# Altium schematic sheet SuperCap.SchDoc
size A4; SheetNumber: 3; SheetTotal: 3
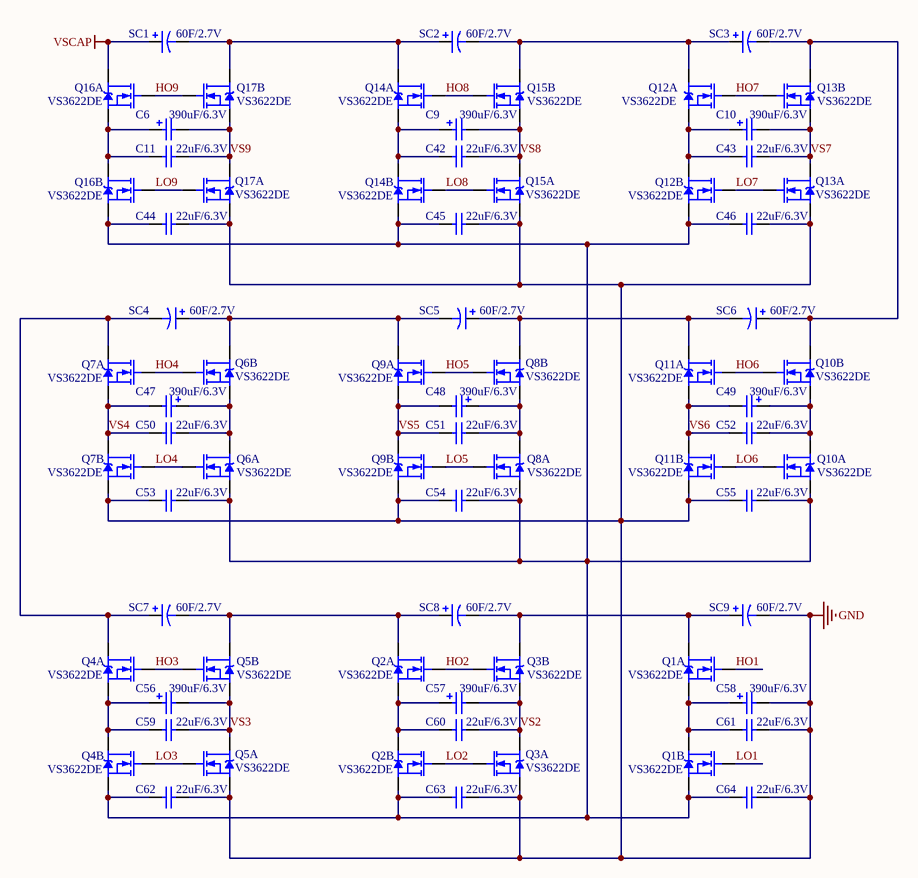
[diagram p0: SuperCap.SchDoc]

## Parts
C6  390uF/6.3V  [CS 8*12 - B]
C9  390uF/6.3V  [CS 8*12 - B]
C10  390uF/6.3V  [CS 8*12 - B]
C11  22uF/6.3V  [C0603_M]
C42  22uF/6.3V  [C0603_M]
C43  22uF/6.3V  [C0603_M]
C44  22uF/6.3V  [C0603_M]
C45  22uF/6.3V  [C0603_M]
C46  22uF/6.3V  [C0603_M]
C47  390uF/6.3V  [CS 8*12 - B]
C48  390uF/6.3V  [CS 8*12 - B]
C49  390uF/6.3V  [CS 8*12 - B]
C50  22uF/6.3V  [C0603_M]
C51  22uF/6.3V  [C0603_M]
C52  22uF/6.3V  [C0603_M]
C53  22uF/6.3V  [C0603_M]
C54  22uF/6.3V  [C0603_M]
C55  22uF/6.3V  [C0603_M]
C56  390uF/6.3V  [CS 8*12 - B]
C57  390uF/6.3V  [CS 8*12 - B]
C58  390uF/6.3V  [CS 8*12 - B]
C59  22uF/6.3V  [C0603_M]
C60  22uF/6.3V  [C0603_M]
C61  22uF/6.3V  [C0603_M]
C62  22uF/6.3V  [C0603_M]
C63  22uF/6.3V  [C0603_M]
C64  22uF/6.3V  [C0603_M]
Q1  VS3622DE  [PDFN3333-8_VS3622DE]  (parts A,B of 2)
Q2  VS3622DE  [PDFN3333-8_VS3622DE]  (parts A,B of 2)
Q3  VS3622DE  [PDFN3333-8_VS3622DE]  (parts A,B of 2)
Q4  VS3622DE  [PDFN3333-8_VS3622DE]  (parts A,B of 2)
Q5  VS3622DE  [PDFN3333-8_VS3622DE]  (parts A,B of 2)
Q6  VS3622DE  [PDFN3333-8_VS3622DE]  (parts A,B of 2)
Q7  VS3622DE  [PDFN3333-8_VS3622DE]  (parts A,B of 2)
Q8  VS3622DE  [PDFN3333-8_VS3622DE]  (parts A,B of 2)
Q9  VS3622DE  [PDFN3333-8_VS3622DE]  (parts A,B of 2)
Q10  VS3622DE  [PDFN3333-8_VS3622DE]  (parts A,B of 2)
Q11  VS3622DE  [PDFN3333-8_VS3622DE]  (parts A,B of 2)
Q12  VS3622DE  [PDFN3333-8_VS3622DE]  (parts A,B of 2)
Q13  VS3622DE  [PDFN3333-8_VS3622DE]  (parts A,B of 2)
Q14  VS3622DE  [PDFN3333-8_VS3622DE]  (parts A,B of 2)
Q15  VS3622DE  [PDFN3333-8_VS3622DE]  (parts A,B of 2)
Q16  VS3622DE  [PDFN3333-8_VS3622DE]  (parts A,B of 2)
Q17  VS3622DE  [PDFN3333-8_VS3622DE]  (parts A,B of 2)
SC1  60F/2.7V  [CE-7.5*18*35.5 - BK]
SC2  60F/2.7V  [CE-7.5*18*35.5 - BK]
SC3  60F/2.7V  [CE-7.5*18*35.5 - BK]
SC4  60F/2.7V  [CE-7.5*18*35.5 - BK]
SC5  60F/2.7V  [CE-7.5*18*35.5 - BK]
SC6  60F/2.7V  [CE-7.5*18*35.5 - BK]
SC7  60F/2.7V  [CE-7.5*18*35.5 - BK]
SC8  60F/2.7V  [CE-7.5*18*35.5 - BK]
SC9  60F/2.7V  [CE-7.5*18*35.5 - BK]

## Nets
GND: C44.2 C45.2 C46.2 C53.1 C54.1 C55.1 C58.2 C61.2 C62.2 C63.2 C64.1 Q3.S1 Q5.S1 Q7.S2 Q9.S2 Q11.S2 Q13.S1 Q15.S1 Q17.S1 SC9.2
VSCAP: Q16.D1 SC1.1
HO1: Q1.G1
HO2: Q2.G1 Q3.G2
HO3: Q4.G1 Q5.G2
HO4: Q6.G2 Q7.G1
HO5: Q8.G2 Q9.G1
HO6: Q10.G2 Q11.G1
HO7: Q12.G1 Q13.G2
HO8: Q14.G1 Q15.G2
HO9: Q16.G1 Q17.G2
LO1: Q1.G2
LO2: Q2.G2 Q3.G1
LO3: Q4.G2 Q5.G1
LO4: Q6.G1 Q7.G2
LO5: Q8.G1 Q9.G2
LO6: Q10.G1 Q11.G2
LO7: Q12.G2 Q13.G1
LO8: Q14.G2 Q15.G1
LO9: Q16.G2 Q17.G1
VS2: C57.2 C60.2 Q3.D1 Q3.S2
VS3: C56.2 C59.2 Q5.D1 Q5.S2
VS4: C47.2 C50.1 Q7.D2 Q7.S1
VS5: C48.2 C51.1 Q9.D2 Q9.S1
VS6: C49.2 C52.1 Q11.D2 Q11.S1
VS7: C10.2 C43.2 Q13.D1 Q13.S2
VS8: C9.2 C42.2 Q15.D1 Q15.S2
VS9: C6.2 C11.2 Q17.D1 Q17.S2
NetC6_1: C6.1 C11.1 Q16.D2 Q16.S1
NetC9_1: C9.1 C42.1 Q14.D2 Q14.S1
NetC10_1: C10.1 C43.1 Q12.D2 Q12.S1
NetC44_1: C44.1 C45.1 C46.1 C53.2 C54.2 C55.2 C62.1 C63.1 C64.2 Q1.S2 Q2.S2 Q4.S2 Q6.S1 Q8.S1 Q10.S1 Q12.S2 Q14.S2 Q16.S2
NetC47_1: C47.1 C50.2 Q6.D1 Q6.S2
NetC48_1: C48.1 C51.2 Q8.D1 Q8.S2
NetC49_1: C49.1 C52.2 Q10.D1 Q10.S2
NetC56_1: C56.1 C59.1 Q4.D2 Q4.S1
NetC57_1: C57.1 C60.1 Q2.D2 Q2.S1
NetC58_1: C58.1 C61.1 Q1.D2 Q1.S1
NetQ1_D1: Q1.D1 Q3.D2 SC8.2 SC9.1
NetQ2_D1: Q2.D1 Q5.D2 SC7.2 SC8.1
NetQ4_D1: Q4.D1 Q7.D1 SC4.2 SC7.1
NetQ6_D2: Q6.D2 Q9.D1 SC4.1 SC5.2
NetQ8_D2: Q8.D2 Q11.D1 SC5.1 SC6.2
NetQ10_D2: Q10.D2 Q13.D2 SC3.2 SC6.1
NetQ12_D1: Q12.D1 Q15.D2 SC2.2 SC3.1
NetQ14_D1: Q14.D1 Q17.D2 SC1.2 SC2.1

## Library data of the parts
C6 C9 C10 C47-C49 C56-C58 = Cap Pol2: Polarized Capacitor (Axial); Published: 8-Jun-2000; LatestRevisionDate: 17-Jul-2002; LatestRevisionNote: Re-released for DXP Platform.; Publisher: Altium Limited; PackageDescription: Polarized Capacitor; 2 Leads
C11 C42-C46 C50-C55 C59-C63 = Cap: Capacitor; Value: 1uF; Published: 8-Jun-2000; LatestRevisionDate: 17-Jul-2002; LatestRevisionNote: Re-released for DXP Platform.; PackageReference: RAD-0.3; Publisher: Altium Limited; PackageDescription: Radial Cap, Thru-Hole; 2 Leads; 0.3 in Pin Spacing
C64 = Cap: Capacitor
SC1-SC9 = Cap Pol1: Polarized Capacitor (Radial)